# Altium schematic sheet USB.schdoc: =
size A4; Symbol: Sheet-Symbol_A4; Company: 嘉立创EDA; Version: V1.0; Page Size: A4; @Project Name: RK3568B2地瓜派; @Page Count: 27; @Update Date: 2025-09-15; @Create Date: 2025-09-11; @Schematic Name: Schematic1; @Page No: 21; @Page Name: USB; Device: Sheet-Symbol_A4; Border: 1; Title Block Position: 3; Width: 1170; Height: 825; Region Start: 1; X Region Count: 6; Y Region Count: 4; Blade Width: 10; @Board Name: Board1; @Create Time: 22:22:48; @Update Time: 14:48:17; Organization: ORGANIZATION; Address1: ADDRESS 1; Address2: ADDRESS 2; Address3: ADDRESS 3; Address4: ADDRESS 4; SheetNumber: 17; SheetTotal: 28
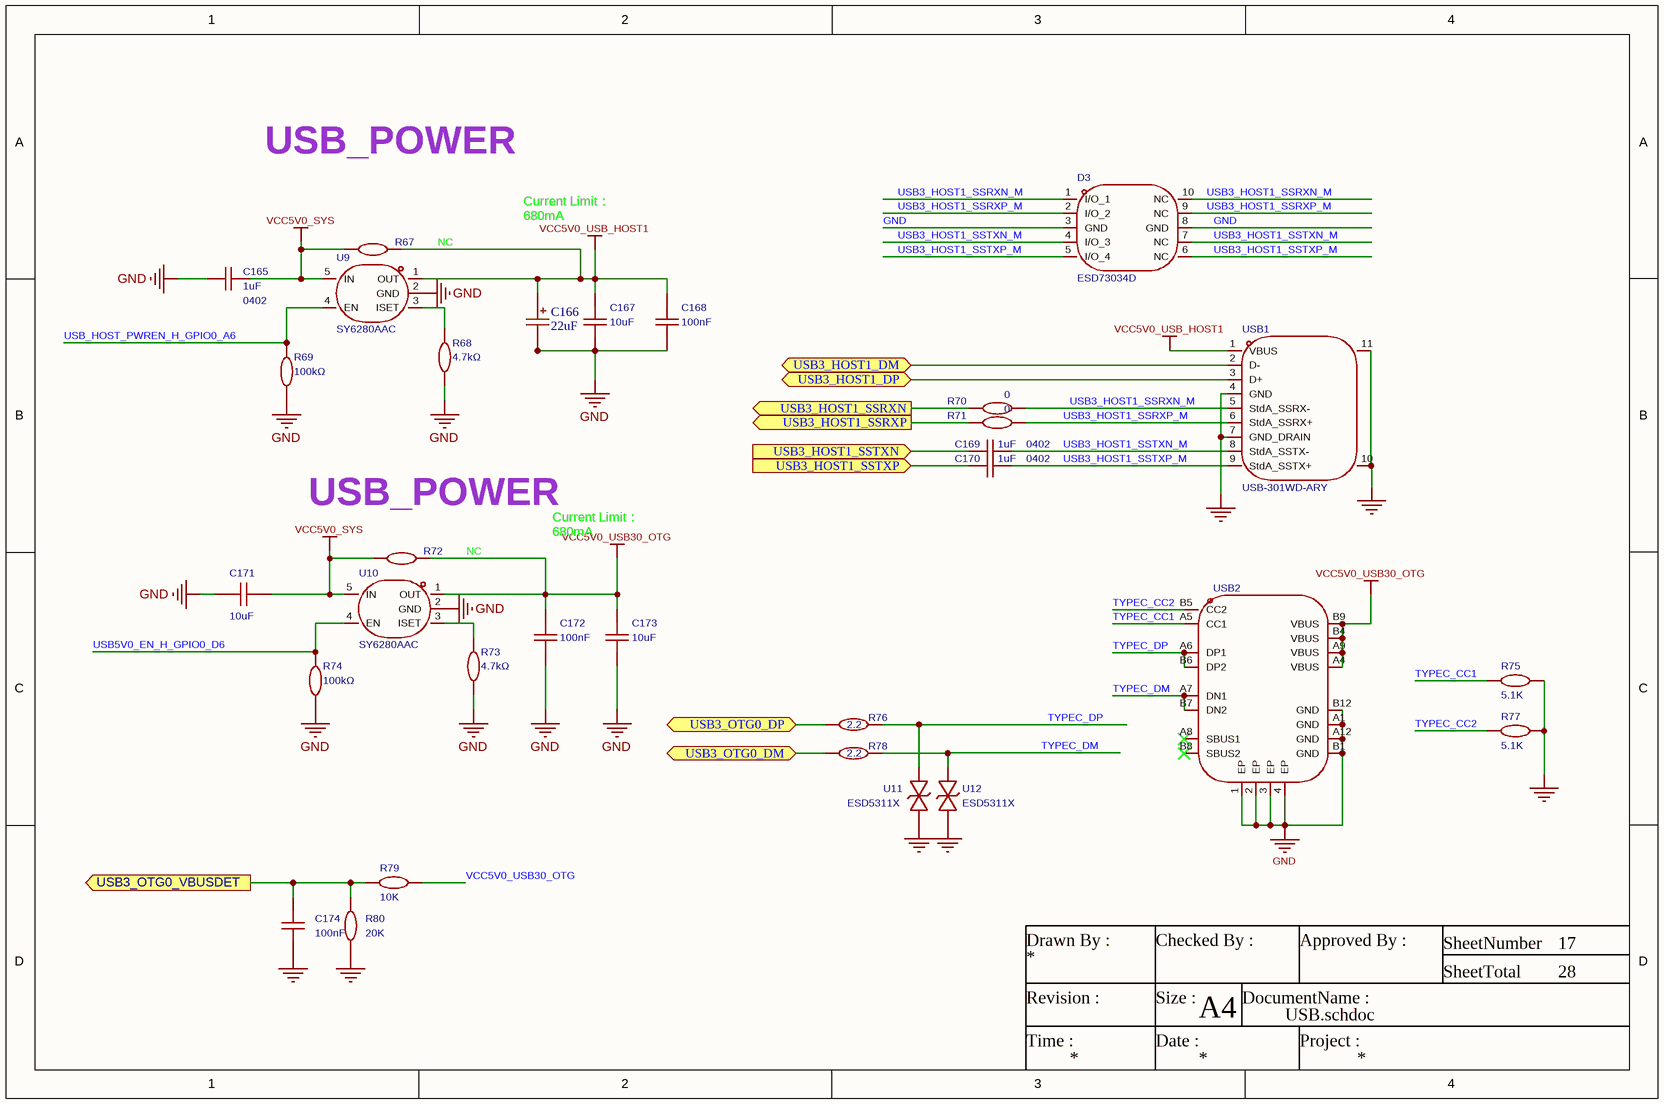
[diagram p0: USB.schdoc]

## Parts
C165  1uF  Supplier Footprint: 0402  [MYC0402]
C166  22uF  [CASE-B_3528]
C167  10uF  [C0603]
C168  100nF  [C0603]
C169  1uF  Supplier Footprint: 0402  [MYC0402]
C170  1uF  Supplier Footprint: 0402  [MYC0402]
C171  10uF  [C0603]
C172  100nF  [C0603]
C173  10uF  [C0603]
C174  value 100nF  [MYC0402]  (hidden comment: CL10A105KB8NNNC)
D3  ESD73034D  [DFN-10_L2.5-W1.0-P0.50-BL-2]
R67  NC  [R0805]
R68  4.7kΩ  [R0402]
R69  100kΩ  [R0402]
R70  0  [R0402]
R71  0  [R0402]
R72  NC  [R0805]
R73  4.7kΩ  [R0402]
R74  100kΩ  [R0402]
R75  5.1K  [R0402]
R76  2.2  [R0402]
R77  5.1K  [R0402]
R78  2.2  [R0402]
R79  10K  [R0402]
R80  20K  [R0402]
U9  SY6280AAC  [SOT-23-5_L3.0-W1.7-P0.95-LS2.8-BL]
U10  SY6280AAC  [SOT-23-5_L3.0-W1.7-P0.95-LS2.8-BL]
U11  ESD5311X  [DFN1006-2L-BI]
U12  ESD5311X  [DFN1006-2L-BI]
USB1  USB-301WD-ARY  [USB-TH_XUNPU_USB-301WD-ARY]
USB2  (no value)  [USB_TYPE-C-16P]

## Ports
USB3_HOST1_DM (bidir), USB3_HOST1_DP (bidir), USB3_HOST1_SSRXN (out), USB3_HOST1_SSRXP (out), USB3_HOST1_SSTXN (in), USB3_HOST1_SSTXP (in), USB3_OTG0_DM (bidir), USB3_OTG0_DP (bidir), USB3_OTG0_VBUSDET (out)

## Nets
GND: C165.1 C166.2 C167.1 C168.1 C171.1 C172.1 C173.1 C174.2 D3.3(GND) D3.8(GND) R68.1 R69.1 R73.1 R74.1 R75.1 R77.1 R80.1 U9.2(GND) U10.2(GND) U11.2 U12.2 USB1.4(GND) USB1.7(GND_DRAIN) USB1.10(SHIELD) USB1.11(SHIELD) USB2.1(EP) USB2.2(EP) USB2.3(EP) USB2.4(EP) USB2.A1(GND) USB2.A12(GND) USB2.B1(GND) USB2.B12(GND)
VCC5V0_SYS: C165.2 C171.2 R67.1 R72.1 U9.5(IN) U10.5(IN)
VCC5V0_USB30_OTG: C172.2 C173.2 R72.2 R79.2 U10.1(OUT) USB2.A4(VBUS) USB2.A9(VBUS) USB2.B4(VBUS) USB2.B9(VBUS)
VCC5V0_USB_HOST1: C166.1 C167.2 C168.2 R67.2 U9.1(OUT) USB1.1(VBUS)
TYPEC_CC1: R75.2 USB2.A5(CC1)
TYPEC_CC2: R77.2 USB2.B5(CC2)
TYPEC_DM: R78.2 U12.1 USB2.A7(DN1) USB2.B7(DN2)
TYPEC_DP: R76.2 U11.1 USB2.A6(DP1) USB2.B6(DP2)
USB3_HOST1_DM: USB1.2(D-) ; port USB3_HOST1_DM
USB3_HOST1_DP: USB1.3(D+) ; port USB3_HOST1_DP
USB3_HOST1_SSRXN: R70.1 ; port USB3_HOST1_SSRXN
USB3_HOST1_SSRXN_M: D3.1(I/O_1) D3.10(NC) R70.2 USB1.5(StdA_SSRX-)
USB3_HOST1_SSRXP: R71.1 ; port USB3_HOST1_SSRXP
USB3_HOST1_SSRXP_M: D3.2(I/O_2) D3.9(NC) R71.2 USB1.6(StdA_SSRX+)
USB3_HOST1_SSTXN: C169.1 ; port USB3_HOST1_SSTXN
USB3_HOST1_SSTXN_M: C169.2 D3.4(I/O_3) D3.7(NC) USB1.8(StdA_SSTX-)
USB3_HOST1_SSTXP: C170.1 ; port USB3_HOST1_SSTXP
USB3_HOST1_SSTXP_M: C170.2 D3.5(I/O_4) D3.6(NC) USB1.9(StdA_SSTX+)
USB3_OTG0_DM: R78.1 ; port USB3_OTG0_DM
USB3_OTG0_DP: R76.1 ; port USB3_OTG0_DP
USB3_OTG0_VBUSDET: C174.1 R79.1 R80.2 ; port USB3_OTG0_VBUSDET
USB5V0_EN_H_GPIO0_D6: R74.2 U10.4(EN)
USB_HOST_PWREN_H_GPIO0_A6: R69.2 U9.4(EN)
NetR68_2: R68.2 U9.3(ISET)
NetR73_2: R73.2 U10.3(ISET)

Not connected (* = marked no-connect by the designer): USB2 A8(SBUS1)* B8(SBUS2)*

## Notes on the sheet
- USB_POWER
- Current Limit：
  680mA
- (near R72) USB_POWER
- (near C173) Current Limit：
  680mA
- Drawn By :
- Checked By :
- Approved By :
- SheetNumber
- SheetTotal
- Revision :
- Time :
- Size :
- Date :
- A4
- DocumentName :
- Project :

## Library data of the parts
C165 = CL05A105KP5NNNC: 容值:1uF;精度:±10%;额定电压:10V;材质(温度系数):X5R;; Manufacturer: SAMSUNG(三星); Voltage Rated: 10V; 3D Model: 36a51122f27c49738f86b3bfa98863e0; 3D Model Transform: 39.37,19.685,0,0,0,0,0,0,0; Tolerance: ±10%; Temperature Coefficient: X5R; AddInBom: yes; ModelName: C0402_L1.0-W0.5-H0.5; Device: CL05A105KP5NNNC; Symbol: CL05A105KP5NNNC; LCSC Part Name: 1uF ±10% 10V; Supplier Part: C14445; Manufacturer Part: CL05A105KP5NNNC; JLCPCB Part Class: 扩展库; Datasheet: https://atta.szlcsc.com/upload/public/pdf/source/20160103/1457707670698.pdf; Supplier: LCSC; Value: 1uF; ConvertToPcb: yes; FootprintName: MYC0402
C166 = TAJB226K016RNJ: 容值:22uF;精度:±10%;额定电压:16V;等效串联电阻(ESR):2.3Ω@100kHz;; Manufacturer: Kyocera AVX; NPNP_COMPONENT_ID: C8020; Tolerance: ?0%; Voltage Rating: 16V; Equivalent Series Resistance(ESR): 2.3Ω@100kHz; JLCPCB Part Class: Extended Part; LCSC Part Name: 22uF ?0% 16V; Manufacturer Part: TAJB226K016RNJ; Operating Temperature: -55℃~+125℃; Supplier: LCSC; Supplier Footprint: CASE-B-3528-21(mm); Supplier Part: C8020; Value: 22uF
C167 C173 = CL10A106KP8NNNC: 容值:10uF;精度:±10%;额定电压:10V;材质(温度系数):X5R;; Manufacturer: SAMSUNG(三星); Symbol: 0603X106M100; AddInBom: yes; ModelId: ac125912035d415993ca9572d50418b1; ModelName: C0603_L1.6-W0.8-H0.8; ModelTransform: 62.992,31.496,0,0,0,0,0,0,0; Tolerance: ±10%; Voltage Rated: 10V; Temperature Coefficient: X5R; Device: CL10A106KP8NNNC; LCSC Part Name: 10uF ±10% 10V; SupplierPart: C19702; ManufacturerPart: CL10A106KP8NNNC; Supplier Footprint: 0603; JLCPCB Part Class: Basic Part; Datasheet: https://atta.szlcsc.com/upload/public/pdf/source/20160103/1457707703378.pdf; Supplier: LCSC; ConvertToPcb: yes; FootprintName: C0603; Value: 10uF
C168 C172 = CC0603KRX7R9BB104: 容值:100nF;精度:±10%;额定电压:50V;材质(温度系数):X7R;; Manufacturer: YAGEO(国巨); AddInBom: yes; ModelId: ac125912035d415993ca9572d50418b1; ModelName: C0603_L1.6-W0.8-H0.8; ModelTransform: 62.992,31.496,0,0,0,0,0,0,0; Tolerance: ±10%; Voltage Rated: 50V; Temperature Coefficient: X7R; Symbol: CC0603KRX7R9BB104; Device: CC0603KRX7R9BB104; LCSC Part Name: 100nF ±10% 50V; SupplierPart: C14663; ManufacturerPart: CC0603KRX7R9BB104; Supplier Footprint: 0603; JLCPCB Part Class: Basic Part; Datasheet: https://atta.szlcsc.com/upload/public/pdf/source/20180910/C282072_33301C7F631E79921B82A8DAC6BCC5B3.pdf; Supplier: LCSC; ConvertToPcb: yes; FootprintName: C0603; Value: 100nF
C169 C170 = CL05A105KP5NNNC: 容值:1uF;精度:±10%;额定电压:10V;材质(温度系数):X5R;; Manufacturer: SAMSUNG(三星); AddInBom: yes; ModelId: 36a51122f27c49738f86b3bfa98863e0; ModelName: C0402_L1.0-W0.5-H0.5; ModelTransform: 39.37,19.685,0,0,0,0,0,0,0; Tolerance: ±10%; Voltage Rated: 10V; Temperature Coefficient: X5R; Device: CL05A105KP5NNNC; Symbol: CL05A105KP5NNNC; LCSC Part Name: 1uF ±10% 10V; SupplierPart: C14445; ManufacturerPart: CL05A105KP5NNNC; JLCPCB Part Class: 扩展库; Datasheet: https://atta.szlcsc.com/upload/public/pdf/source/20160103/1457707670698.pdf; Supplier: LCSC; ConvertToPcb: yes; FootprintName: MYC0402; Value: 1uF
C171 = CAP_0603: Symbol: Capacitance; 3D Model: ac125912035d415993ca9572d50418b1聨0819f05c4eef4c71ace90d822a990e87; 3D Model Transform: 62.992,31.496,0,0,0,0,0,0,0; ConvertToPcb: yes; ModelName: C0603_L1.6-W0.8-H0.8; Device: CAP_0603; Supplier Footprint: 0603; Value: 10uF; AddInBom: yes; FootprintName: C0603
C174 = CL10A105KB8NNNC: 容值:1uF;精度:±10%;额定电压:50V;材质(温度系数):X5R;; Manufacturer: SAMSUNG(三星); Symbol: CapAcitance; AddInBom: yes; ModelId: ac125912035d415993ca9572d50418b1; ModelName: C0603_L1.6-W0.8-H0.8; ModelTransform: 62.992,31.496,0,0,0,0,0,0,0; Tolerance: ±10%; Voltage Rated: 50V; Temperature Coefficient: X5R; Device: CL10A105KB8NNNC; LCSC Part Name: 1uF ±10% 50V; ManufacturerPart: CL10A105KB8NNNC; Supplier Footprint: 0603; JLCPCB Part Class: Basic Part; Datasheet: https://atta.szlcsc.com/upload/public/pdf/source/20160103/1457707679084.pdf; Supplier: LCSC; ConvertToPcb: yes; FootprintName: MYC0402
D3 = ESD73034D: 极性:双向;反向截止电压(Vrwm):3.3V;钳位电压:18V;峰值脉冲电流(Ipp):3A@8/20us;峰值脉冲功率(Ppp):60W@8/20us;击穿电压:8.5V;; Manufacturer: TECH PUBLIC(台舟); AddInBom: yes; ModelId: bdfd66bff1204c318d65223fd39cc645; ModelTransform: 40.1574,98.8187,0,90,0,0,0,0,0; Polarity: 双向; Reverse Stand-Off Voltage (Vrwm): 3.3V; Clamping Voltage: 18V; Voltage - Breakdown: 8.5V; Reverse Leakage Current (Ir): 200nA; Number of Channels: 四路; level of protection: IEC 61000-4-5；IEC 61000-4-2; Type: ESD; Junction Capacitance: 0.25pF; Symbol: ESD73034D; Device: ESD73034D; LCSC Part Name: ESD73034D-10/TR; SupplierPart: C7202962; ManufacturerPart: ESD73034D; Supplier Footprint: DFN2510-10; JLCPCB Part Class: 扩展库; Datasheet: https://item.szlcsc.com/datasheet/ESD73034D/8170920.html; Supplier: LCSC; ConvertToPcb: yes; FootprintName: DFN-10_L2.5-W1.0-P0.50-BL-2; ModelName: DFN-10_L2.5-W1.0-P0.50-BL-2; Peak Pulse Current (Ipp): 3A@8/20us; Peak Pulse Power Dissipation (Ppp): 60W@8/20us
R67 R72 = 0805W8F0000T5E: 电阻类型:厚膜电阻;阻值:0Ω;精度:±1%;功率:125mW;温度系数:±800ppm/℃;最大工作电压:150V;工作温度范围:-55℃~+155℃;; Manufacturer: UNI-ROYAL(厚声); AddInBom: yes; ModelId: 37a81e68749a4138bd2dfa6897b24b85; ModelName: R0805_L2.0-W1.3-H0.6; ModelTransform: 78.74,51.181,0,0,0,0,0,-0.0005,0; Tolerance: ±1%; Power(Watts): 125mW; Overload Voltage (Max): 150V; Supplier Part: NC; Value: NC; Device: 0805W8F0000T5E; Symbol: 0805W8F0000T5E; LCSC Part Name: 0Ω ±1% 125mW; ManufacturerPart: 0805W8F0000T5E; Supplier Footprint: 0805; JLCPCB Part Class: Basic Part; Datasheet: https://atta.szlcsc.com/upload/public/pdf/source/20200306/C422600_1E6D84923E4A46A82E41ADD87F860B5C.pdf; Supplier: LCSC; ConvertToPcb: yes; FootprintName: R0805; Type: 厚膜电阻; Temperature Coefficient: ±800ppm/℃; Operating Temperature Range: -55℃~+155℃
R68 R69 R73 R74 = CRCW040210K0FKED: 电阻类型:厚膜电阻;阻值:10kΩ;精度:±1%;功率:63mW;温度系数:±100ppm/K;最大工作电压:50V;工作温度范围:-55℃~+155℃;; Manufacturer: VISHAY(威世); AddInBom: yes; ModelId: 671aefced39d4c318694bba8bd8efd39; ModelName: R0402_L1.0-W0.5-H0.5; ModelTransform: 39.37,19.685,0,0,0,0,0,0.0005,0; Tolerance: ±1%; Power(Watts): 63mW; Overload Voltage (Max): 50V; Device: CRCW040210K0FKED; Symbol: CRCW040210K0FKED; LCSC Part Name: 10kΩ ±1% 63mW; ManufacturerPart: CRCW040210K0FKED; Supplier Footprint: 0402; JLCPCB Part Class: 扩展库; Datasheet: https://atta.szlcsc.com/upload/public/pdf/source/20180224/C71617_15194370300791364062.pdf; Supplier: LCSC; ConvertToPcb: yes; FootprintName: R0402; Type: 厚膜电阻; Temperature Coefficient: ±100ppm/K; Operating Temperature Range: -55℃~+155℃
  R68 R73: Value: 4.7kΩ
  R69 R74: Value: 100kΩ
R70 R71 R75-R80 = Res_0402: Symbol: 电阻; ConvertToPcb: yes; ModelId: 671aefced39d4c318694bba8bd8efd39; ModelName: R0402_L1.0-W0.5-H0.5; ModelTransform: 39.37,19.685,0,0,0,0,0,0.0005,0; Device: Res_0402; AddInBom: yes; Supplier Footprint: 0402; FootprintName: R0402
  R70 R71: Value: 0
  R75 R77: Value: 5.1K
  R76 R78: Value: 2.2
  R79: Value: 10K
  R80: Value: 20K
U9 U10 = SY6280AAC_C55136: 低能耗配电开关; Manufacturer: silergy(矽力杰); AddInBom: yes; ModelId: 0a2a1b8f50944f73965918ad6e5fe167; ModelName: SOT-23-5_L2.9-W1.6-H1.1-LS2.8-P0.95; ModelTransform: 118.60433,114.173,0,90,0,0,0.0005,0.0005,0; Device: SY6280AAC_C55136; Symbol: SY6280AAC; LCSC Part Name: SY6280AAC; SupplierPart: C55136; ManufacturerPart: SY6280AAC; Supplier Footprint: SOT-23-5; JLCPCB Part Class: Extended Part; Datasheet: https://atta.szlcsc.com/upload/public/pdf/source/20161108/1478586372822.pdf; Supplier: LCSC; ConvertToPcb: yes; FootprintName: SOT-23-5_L3.0-W1.7-P0.95-LS2.8-BL
U11 U12 = ESD5311X_C2844730: 极性:双向;反向截止电压(Vrwm):5V;最大钳位电压:21V;峰值脉冲电流(Ipp):4A;峰值脉冲功率(Ppp):80W;击穿电压:7.5V;; Manufacturer: TECH PUBLIC(台舟); AddInBom: yes; ModelId: 2bdbcca3b35b49c5a8ae725a08658930; ModelTransform: 40.1574,24.4094,0,0,0,0,0,0,0; polarity: 双向; Reverse Stand-Off Voltage (Vrwm): 5V; Maximum Clamping Voltage: 21V; Peak Pulse Current (Ipp): 4A; Peak Pulse Power Dissipation (Ppp): 80W; Breakdown Voltage: 7.5V; Reverse Leakage Current (Ir): 80nA; Number of Lines: 单路; level of protection: IEC 61000-4-2; Symbol: ESD5311X_C2844730; Device: ESD5311X_C2844730; LCSC Part Name: ESD5311X; SupplierPart: C2844730; ManufacturerPart: ESD5311X; Supplier Footprint: DFN1006-2; JLCPCB Part Class: 扩展库; Datasheet: https://atta.szlcsc.com/upload/public/pdf/source/20210709/C2844730_C8067B3CCE558E7D499244211FB5DC21.pdf; Supplier: LCSC; ConvertToPcb: yes; FootprintName: DFN1006-2L-BI; ModelName: DFN1006-2L-BI; Operating Temperature: -55℃~+125℃; Type: ESD
USB1 = USB-301WD-ARY: 连接器类型:Type-A;协议标准:USB 3.0;公母:母;安装方式:弯插;触点数量:9P;端口数量:1;额定电流 - 电源:1.8A;工作温度:-55℃~+85℃;; Manufacturer: XUNPU(讯普); AddInBom: yes; ModelId: 132fa2449e784102b2ac907af48270b0; ModelTransform: 622.05687,649.605,0,0,0,0,0,-209.84,-118.11; Connector Type: Type-A; Protocol Standard: USB 3.0; Gender: 母; Number of Contacts: 9P; Number of Ports: 1; Current Rating-Power: 1.8A; Voltage Rating: 30V; Detection color: 蓝色; Symbol: USB-301WD-ARY; Device: USB-301WD-ARY; LCSC Part Name: Type-A 母 弯插; SupplierPart: C2895025; ManufacturerPart: USB-301WD-ARY; Supplier Footprint: 插件; JLCPCB Part Class: 扩展库; Datasheet: https://item.szlcsc.com/datasheet/USB-301WD-ARY/3132962.html; Supplier: LCSC; ConvertToPcb: yes; FootprintName: USB-TH_XUNPU_USB-301WD-ARY; ModelName: USB-TH_XUNPU_USB-301WD-ARY; Mounting Type: 弯插; Length: 16.5mm; Operating Temperature: -55℃~+85℃
USB2 = USB_TYPE-C-16P: AddInBom: yes; ModelId: 35058e297fd54ee2afd2de30c3ce7155; ModelName: USB-C_SMD-TYPE-C-31-M-12; ModelTransform: 360,318.121,0,180,0,0,0,-41.02,-39.37; Device: USB_TYPE-C-16P; Symbol: USB_TYPE-C-16P; Supplier Footprint: SMD; ConvertToPcb: yes; FootprintName: USB_TYPE-C-16P